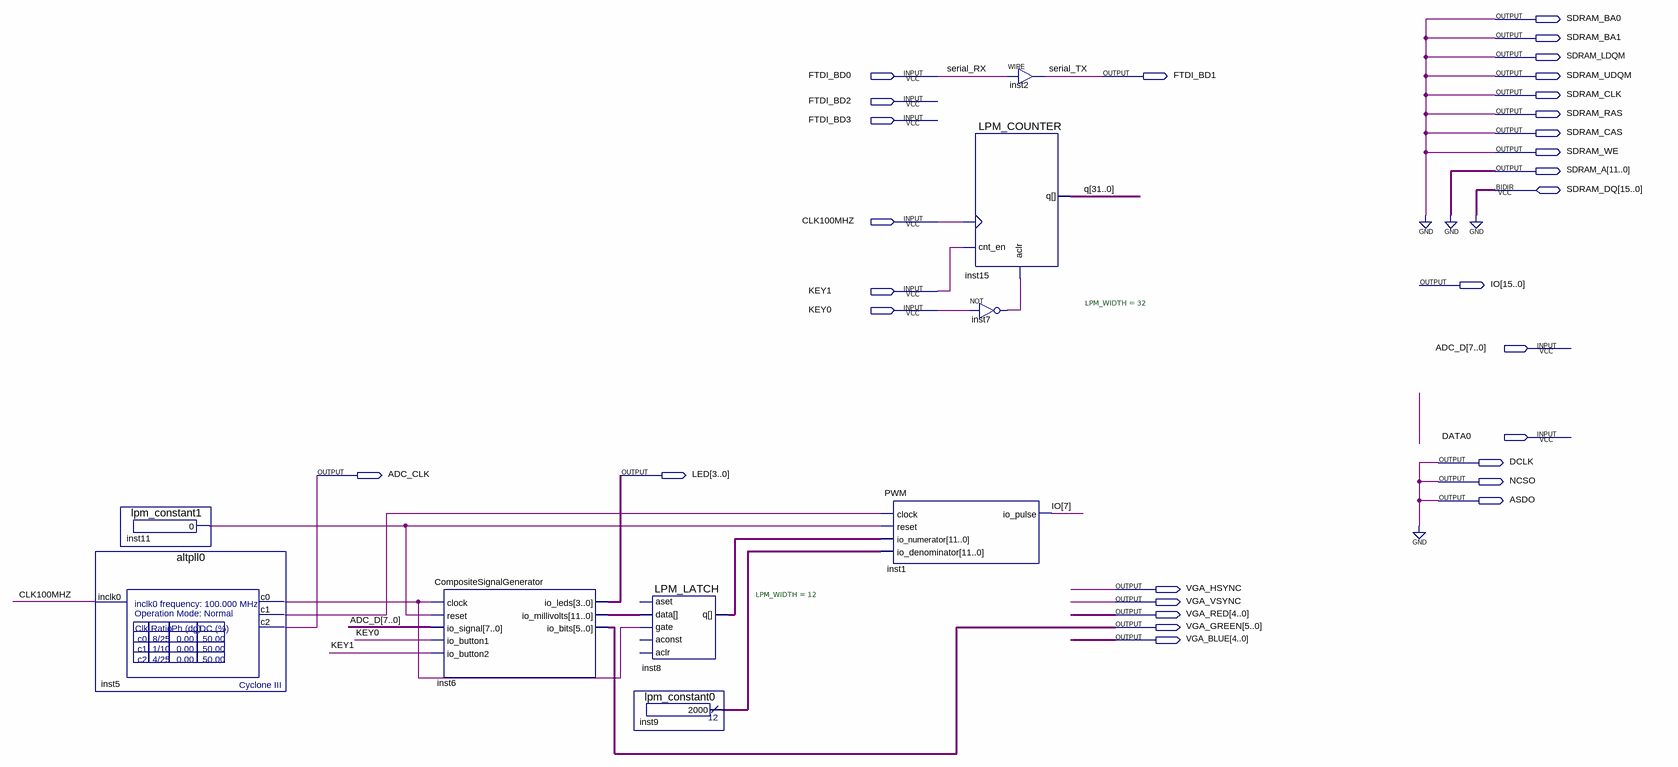
[diagram p0: schematic sheet]
// Quartus schematic cyclone3.bdf as structural Verilog: 9 symbols, 30 pins
module cyclone3 (
  input  FTDI_BD0,
  input  FTDI_BD2,
  input  FTDI_BD3,
  input  CLK100MHZ,
  input  KEY1,
  input  KEY0,
  input  [7:0] ADC_D,
  input  DATA0,
  inout  [15:0] SDRAM_DQ,
  output SDRAM_BA0,
  output SDRAM_BA1,
  output SDRAM_LDQM,
  output FTDI_BD1,
  output SDRAM_UDQM,
  output SDRAM_CLK,
  output SDRAM_RAS,
  output SDRAM_CAS,
  output SDRAM_WE,
  output [11:0] SDRAM_A,
  output [15:0] IO,
  output DCLK,
  output ADC_CLK,
  output [3:0] LED,
  output NCSO,
  output ASDO,
  output VGA_HSYNC,
  output VGA_VSYNC,
  output [4:0] VGA_RED,
  output [5:0] VGA_GREEN,
  output [4:0] VGA_BLUE
);

  wire inst5_c0, inst5_c1, inst7_out, inst11_result;
  wire [11:0] inst6_io_millivolts, inst8_q, inst9_result;
  wire [31:0] q;

  lpm_constant1 inst11 (.result(inst11_result));
  altpll0 inst5 (.inclk0(CLK100MHZ), .c0(inst5_c0), .c1(inst5_c1), .c2(ADC_CLK));
  CompositeSignalGenerator inst6 (
    .clock(inst5_c0), .reset(inst11_result), .io_signal(ADC_D), .io_button1(KEY0), .io_button2(KEY1),
    .io_leds(LED), .io_millivolts(inst6_io_millivolts), .io_bits(VGA_GREEN));
  LPM_LATCH #(.LPM_WIDTH(12)) inst8 (
    .data(inst6_io_millivolts), .gate(inst5_c0), .q(inst8_q));  // open: aset, aconst, aclr
  lpm_constant0 inst9 (.result(inst9_result));
  PWM inst1 (
    .clock(inst5_c1), .reset(inst11_result), .io_numerator(inst8_q), .io_denominator(inst9_result),
    .io_pulse(IO[7]));
  LPM_COUNTER #(.LPM_WIDTH(32)) inst15 (.aclr(inst7_out), .clock(CLK100MHZ), .cnt_en(KEY1), .q(q));
  not inst7 (inst7_out, KEY0);
  assign FTDI_BD1 = FTDI_BD0;  // WIRE inst2

  assign ASDO = 1'b0;
  assign DCLK = 1'b0;
  assign NCSO = 1'b0;
  assign SDRAM_A = {12{1'b0}};
  assign SDRAM_BA0 = 1'b0;
  assign SDRAM_BA1 = 1'b0;
  assign SDRAM_CAS = 1'b0;
  assign SDRAM_CLK = 1'b0;
  assign SDRAM_LDQM = 1'b0;
  assign SDRAM_RAS = 1'b0;
  assign SDRAM_UDQM = 1'b0;
  assign SDRAM_WE = 1'b0;
  // also tied to GND on the sheet: {SDRAM_DQ[0], SDRAM_DQ[1], SDRAM_DQ[2], SDRAM_DQ[3], SDRAM_DQ[4], SDRAM_DQ[5], SDRAM_DQ[6], SDRAM_DQ[7], SDRAM_DQ[8], SDRAM_DQ[9], SDRAM_DQ[10], SDRAM_DQ[11], SDRAM_DQ[12], SDRAM_DQ[13], SDRAM_DQ[14], SDRAM_DQ[15]}

  // Other names for the same wires on the sheet: serial_RX = FTDI_BD0; serial_TX = FTDI_BD1
endmodule
